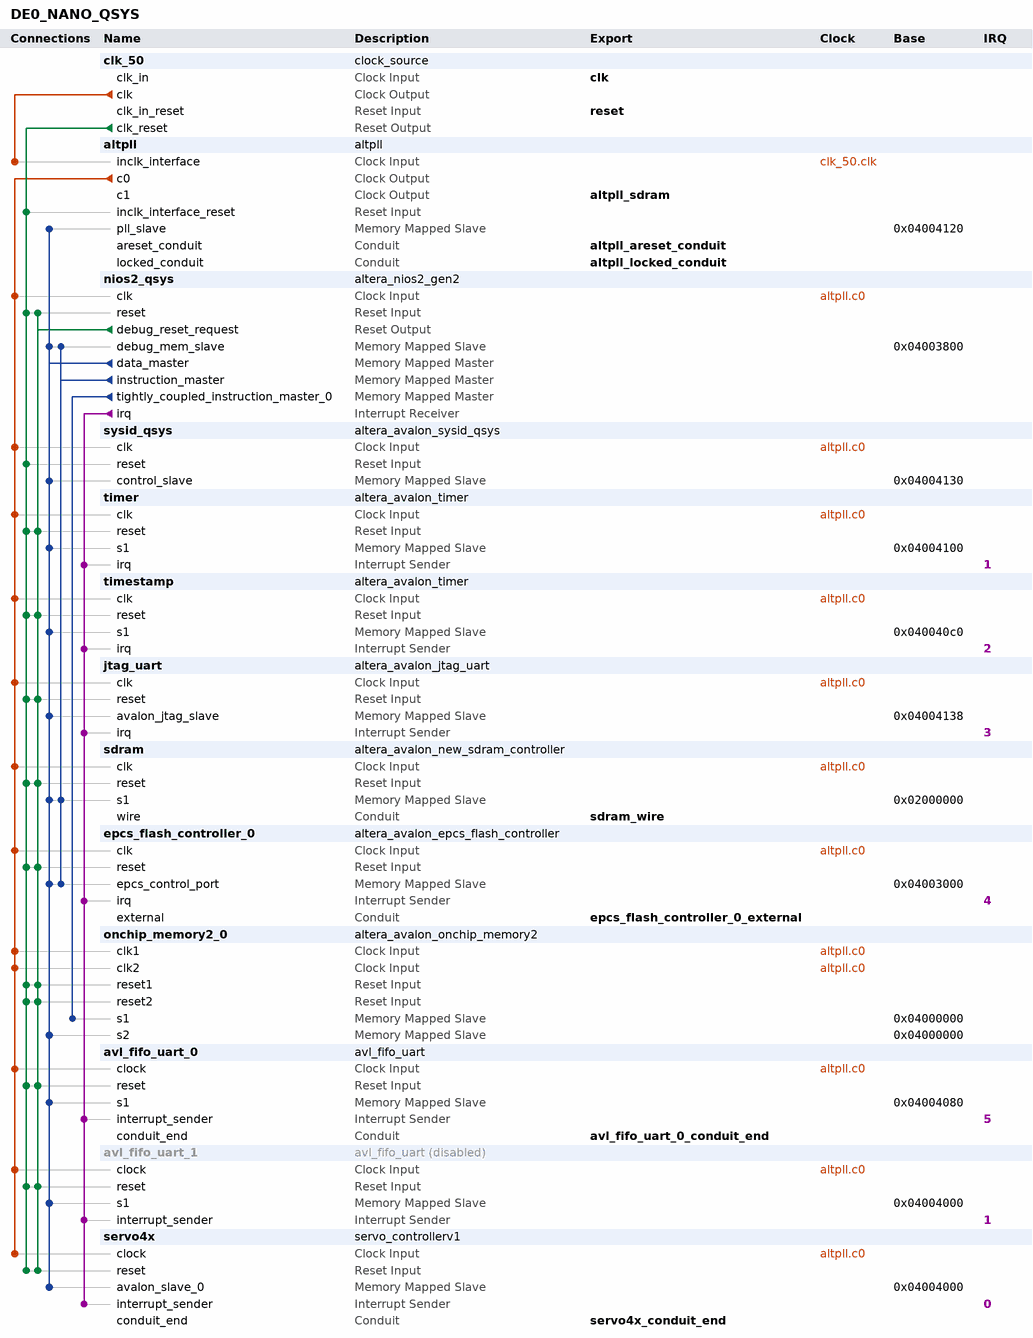
[diagram p0: system contents]
# Platform Designer (Qsys) system DE0_NANO_QSYS, Cyclone IV E EP4CE22F17C6
# Parameters at their usual value, and those the tool derives, are not listed.
package require -exact qsys 18.1
create_system DE0_NANO_QSYS
set_project_property DEVICE_FAMILY {Cyclone IV E}
set_project_property DEVICE EP4CE22F17C6

add_instance clk_50 clock_source 18.1
set_instance_parameter_value clk_50 clockFrequency 50000000

add_instance altpll altpll 18.1
set_instance_parameter_value altpll CLK0_DIVIDE_BY 1
set_instance_parameter_value altpll CLK0_MULTIPLY_BY 2
set_instance_parameter_value altpll CLK1_DIVIDE_BY 1
set_instance_parameter_value altpll CLK1_DUTY_CYCLE 50
set_instance_parameter_value altpll CLK1_MULTIPLY_BY 2
set_instance_parameter_value altpll CLK1_PHASE_SHIFT -1667
set_instance_parameter_value altpll INCLK0_INPUT_FREQUENCY 20000
set_instance_parameter_value altpll PORT_ARESET PORT_USED
set_instance_parameter_value altpll PORT_LOCKED PORT_USED
set_instance_parameter_value altpll PORT_clk1 PORT_USED
set_instance_parameter_value altpll PORT_clk2 PORT_UNUSED
set_instance_parameter_value altpll PORT_clk3 PORT_UNUSED

add_instance nios2_qsys altera_nios2_gen2 18.1
set_instance_parameter_value nios2_qsys dcache_size 4096
set_instance_parameter_value nios2_qsys exceptionSlave onchip_memory2_0.s1
set_instance_parameter_value nios2_qsys icache_numTCIM 1
set_instance_parameter_value nios2_qsys icache_size 4096
set_instance_parameter_value nios2_qsys impl Fast
set_instance_parameter_value nios2_qsys resetSlave epcs_flash_controller_0.epcs_control_port
set_instance_parameter_value nios2_qsys setting_activateTrace true
set_instance_parameter_value nios2_qsys setting_shadowRegisterSets 63

add_instance sysid_qsys altera_avalon_sysid_qsys 18.1
set_instance_parameter_value sysid_qsys id 0

add_instance timer altera_avalon_timer 18.1
set_instance_parameter_value timer period 1
set_instance_parameter_value timer periodUnits MSEC

add_instance timestamp altera_avalon_timer 18.1
set_instance_parameter_value timestamp counterSize 64
set_instance_parameter_value timestamp period 9223372036854775807
set_instance_parameter_value timestamp periodUnits CLOCKS

add_instance jtag_uart altera_avalon_jtag_uart 18.1
set_instance_parameter_value jtag_uart simInteractiveOptions NO_INTERACTIVE_WINDOWS

add_instance sdram altera_avalon_new_sdram_controller 18.1
set_instance_parameter_value sdram TAC 5.5
set_instance_parameter_value sdram TRCD 20.0
set_instance_parameter_value sdram TRP 20.0
set_instance_parameter_value sdram casLatency 3
set_instance_parameter_value sdram columnWidth 9
set_instance_parameter_value sdram dataWidth 16
set_instance_parameter_value sdram generateSimulationModel true
set_instance_parameter_value sdram model single_Micron_MT48LC4M32B2_7_chip
set_instance_parameter_value sdram numberOfBanks 4
set_instance_parameter_value sdram numberOfChipSelects 1
set_instance_parameter_value sdram powerUpDelay 100.0
set_instance_parameter_value sdram refreshPeriod 15.625
set_instance_parameter_value sdram rowWidth 13

add_instance epcs_flash_controller_0 altera_avalon_epcs_flash_controller 18.1
set_instance_parameter_value epcs_flash_controller_0 resetrequest_enabled true

add_instance onchip_memory2_0 altera_avalon_onchip_memory2 18.1
set_instance_parameter_value onchip_memory2_0 dataWidth 32
set_instance_parameter_value onchip_memory2_0 dualPort true
set_instance_parameter_value onchip_memory2_0 initMemContent true
set_instance_parameter_value onchip_memory2_0 initializationFileName onchip_mem.hex
set_instance_parameter_value onchip_memory2_0 memorySize 8192

add_instance avl_fifo_uart_0 avl_fifo_uart 1.0
set_instance_parameter_value avl_fifo_uart_0 BAUDRATE 921600
set_instance_parameter_value avl_fifo_uart_0 C_RX_THRESHOLD 32
set_instance_parameter_value avl_fifo_uart_0 DATA_BIT 8
set_instance_parameter_value avl_fifo_uart_0 FREQ_CLK 100000000
set_instance_parameter_value avl_fifo_uart_0 OVERSAMPLING_RATE 4
set_instance_parameter_value avl_fifo_uart_0 PARITY_BIT 0
set_instance_parameter_value avl_fifo_uart_0 RX_FIFO_DEPTH 8
set_instance_parameter_value avl_fifo_uart_0 RX_TIMEOUT_WORD 4
set_instance_parameter_value avl_fifo_uart_0 STOP_BIT 0
set_instance_parameter_value avl_fifo_uart_0 TX_FIFO_DEPTH 8

add_instance avl_fifo_uart_1 avl_fifo_uart 1.0
set_instance_property avl_fifo_uart_1 ENABLED false
set_instance_parameter_value avl_fifo_uart_1 BAUDRATE 921600
set_instance_parameter_value avl_fifo_uart_1 C_RX_THRESHOLD 32
set_instance_parameter_value avl_fifo_uart_1 DATA_BIT 8
set_instance_parameter_value avl_fifo_uart_1 FREQ_CLK 100000000
set_instance_parameter_value avl_fifo_uart_1 OVERSAMPLING_RATE 4
set_instance_parameter_value avl_fifo_uart_1 PARITY_BIT 0
set_instance_parameter_value avl_fifo_uart_1 RX_FIFO_DEPTH 8
set_instance_parameter_value avl_fifo_uart_1 RX_TIMEOUT_WORD 4
set_instance_parameter_value avl_fifo_uart_1 STOP_BIT 0
set_instance_parameter_value avl_fifo_uart_1 TX_FIFO_DEPTH 8

add_instance servo4x servo_controllerv1 1.0
set_instance_parameter_value servo4x C_MODE0 0
set_instance_parameter_value servo4x C_MODE1 0
set_instance_parameter_value servo4x C_MODE2 0
set_instance_parameter_value servo4x C_MODE3 0
set_instance_parameter_value servo4x FREQ_CLK 100000000
set_instance_parameter_value servo4x PWM_BASE_FREQ 1000000
set_instance_parameter_value servo4x PWM_FREQ 5000
set_instance_parameter_value servo4x SPI_SPEED 1000000

# connections
add_connection altpll.c0 avl_fifo_uart_0.clock clock
add_connection altpll.c0 avl_fifo_uart_1.clock clock
add_connection altpll.c0 epcs_flash_controller_0.clk clock
add_connection altpll.c0 jtag_uart.clk clock
add_connection altpll.c0 nios2_qsys.clk clock
add_connection altpll.c0 onchip_memory2_0.clk1 clock
add_connection altpll.c0 onchip_memory2_0.clk2 clock
add_connection altpll.c0 sdram.clk clock
add_connection altpll.c0 servo4x.clock clock
add_connection altpll.c0 sysid_qsys.clk clock
add_connection altpll.c0 timer.clk clock
add_connection altpll.c0 timestamp.clk clock
add_connection clk_50.clk altpll.inclk_interface clock
add_connection clk_50.clk_reset altpll.inclk_interface_reset reset
add_connection clk_50.clk_reset avl_fifo_uart_0.reset reset
add_connection clk_50.clk_reset avl_fifo_uart_1.reset reset
add_connection clk_50.clk_reset epcs_flash_controller_0.reset reset
add_connection clk_50.clk_reset jtag_uart.reset reset
add_connection clk_50.clk_reset nios2_qsys.reset reset
add_connection clk_50.clk_reset onchip_memory2_0.reset1 reset
add_connection clk_50.clk_reset onchip_memory2_0.reset2 reset
add_connection clk_50.clk_reset sdram.reset reset
add_connection clk_50.clk_reset servo4x.reset reset
add_connection clk_50.clk_reset sysid_qsys.reset reset
add_connection clk_50.clk_reset timer.reset reset
add_connection clk_50.clk_reset timestamp.reset reset
add_connection nios2_qsys.debug_reset_request avl_fifo_uart_0.reset reset
add_connection nios2_qsys.debug_reset_request avl_fifo_uart_1.reset reset
add_connection nios2_qsys.debug_reset_request epcs_flash_controller_0.reset reset
add_connection nios2_qsys.debug_reset_request jtag_uart.reset reset
add_connection nios2_qsys.debug_reset_request nios2_qsys.reset reset
add_connection nios2_qsys.debug_reset_request onchip_memory2_0.reset1 reset
add_connection nios2_qsys.debug_reset_request onchip_memory2_0.reset2 reset
add_connection nios2_qsys.debug_reset_request sdram.reset reset
add_connection nios2_qsys.debug_reset_request servo4x.reset reset
add_connection nios2_qsys.debug_reset_request timer.reset reset
add_connection nios2_qsys.debug_reset_request timestamp.reset reset
add_connection nios2_qsys.data_master altpll.pll_slave avalon
set_connection_parameter_value nios2_qsys.data_master/altpll.pll_slave baseAddress 0x04004120
add_connection nios2_qsys.data_master avl_fifo_uart_0.s1 avalon
set_connection_parameter_value nios2_qsys.data_master/avl_fifo_uart_0.s1 baseAddress 0x04004080
add_connection nios2_qsys.data_master avl_fifo_uart_1.s1 avalon
set_connection_parameter_value nios2_qsys.data_master/avl_fifo_uart_1.s1 baseAddress 0x04004000
add_connection nios2_qsys.data_master epcs_flash_controller_0.epcs_control_port avalon
set_connection_parameter_value nios2_qsys.data_master/epcs_flash_controller_0.epcs_control_port baseAddress 0x04003000
add_connection nios2_qsys.data_master jtag_uart.avalon_jtag_slave avalon
set_connection_parameter_value nios2_qsys.data_master/jtag_uart.avalon_jtag_slave baseAddress 0x04004138
add_connection nios2_qsys.data_master nios2_qsys.debug_mem_slave avalon
set_connection_parameter_value nios2_qsys.data_master/nios2_qsys.debug_mem_slave baseAddress 0x04003800
add_connection nios2_qsys.data_master onchip_memory2_0.s2 avalon
set_connection_parameter_value nios2_qsys.data_master/onchip_memory2_0.s2 baseAddress 0x04000000
add_connection nios2_qsys.data_master sdram.s1 avalon
set_connection_parameter_value nios2_qsys.data_master/sdram.s1 baseAddress 0x02000000
add_connection nios2_qsys.data_master servo4x.avalon_slave_0 avalon
set_connection_parameter_value nios2_qsys.data_master/servo4x.avalon_slave_0 baseAddress 0x04004000
add_connection nios2_qsys.data_master sysid_qsys.control_slave avalon
set_connection_parameter_value nios2_qsys.data_master/sysid_qsys.control_slave baseAddress 0x04004130
add_connection nios2_qsys.data_master timer.s1 avalon
set_connection_parameter_value nios2_qsys.data_master/timer.s1 baseAddress 0x04004100
add_connection nios2_qsys.data_master timestamp.s1 avalon
set_connection_parameter_value nios2_qsys.data_master/timestamp.s1 baseAddress 0x040040c0
add_connection nios2_qsys.instruction_master epcs_flash_controller_0.epcs_control_port avalon
set_connection_parameter_value nios2_qsys.instruction_master/epcs_flash_controller_0.epcs_control_port baseAddress 0x04003000
add_connection nios2_qsys.instruction_master nios2_qsys.debug_mem_slave avalon
set_connection_parameter_value nios2_qsys.instruction_master/nios2_qsys.debug_mem_slave baseAddress 0x04003800
add_connection nios2_qsys.instruction_master sdram.s1 avalon
set_connection_parameter_value nios2_qsys.instruction_master/sdram.s1 baseAddress 0x02000000
add_connection nios2_qsys.tightly_coupled_instruction_master_0 onchip_memory2_0.s1 avalon
set_connection_parameter_value nios2_qsys.tightly_coupled_instruction_master_0/onchip_memory2_0.s1 baseAddress 0x04000000
add_connection nios2_qsys.irq avl_fifo_uart_0.interrupt_sender interrupt
set_connection_parameter_value nios2_qsys.irq/avl_fifo_uart_0.interrupt_sender irqNumber 5
add_connection nios2_qsys.irq avl_fifo_uart_1.interrupt_sender interrupt
set_connection_parameter_value nios2_qsys.irq/avl_fifo_uart_1.interrupt_sender irqNumber 1
add_connection nios2_qsys.irq epcs_flash_controller_0.irq interrupt
set_connection_parameter_value nios2_qsys.irq/epcs_flash_controller_0.irq irqNumber 4
add_connection nios2_qsys.irq jtag_uart.irq interrupt
set_connection_parameter_value nios2_qsys.irq/jtag_uart.irq irqNumber 3
add_connection nios2_qsys.irq servo4x.interrupt_sender interrupt
set_connection_parameter_value nios2_qsys.irq/servo4x.interrupt_sender irqNumber 0
add_connection nios2_qsys.irq timer.irq interrupt
set_connection_parameter_value nios2_qsys.irq/timer.irq irqNumber 1
add_connection nios2_qsys.irq timestamp.irq interrupt
set_connection_parameter_value nios2_qsys.irq/timestamp.irq irqNumber 2

# exported interfaces
add_interface altpll_areset_conduit conduit end
set_interface_property altpll_areset_conduit EXPORT_OF altpll.areset_conduit
add_interface altpll_locked_conduit conduit end
set_interface_property altpll_locked_conduit EXPORT_OF altpll.locked_conduit
add_interface altpll_sdram clock source
set_interface_property altpll_sdram EXPORT_OF altpll.c1
add_interface avl_fifo_uart_0_conduit_end conduit end
set_interface_property avl_fifo_uart_0_conduit_end EXPORT_OF avl_fifo_uart_0.conduit_end
add_interface clk clock sink
set_interface_property clk EXPORT_OF clk_50.clk_in
add_interface epcs_flash_controller_0_external conduit end
set_interface_property epcs_flash_controller_0_external EXPORT_OF epcs_flash_controller_0.external
add_interface reset reset sink
set_interface_property reset EXPORT_OF clk_50.clk_in_reset
add_interface sdram_wire conduit end
set_interface_property sdram_wire EXPORT_OF sdram.wire
add_interface servo4x_conduit_end conduit end
set_interface_property servo4x_conduit_end EXPORT_OF servo4x.conduit_end

set_interconnect_requirement {$system} qsys_mm.clockCrossingAdapter HANDSHAKE
set_interconnect_requirement {$system} qsys_mm.maxAdditionalLatency 1

save_system DE0_NANO_QSYS.qsys
